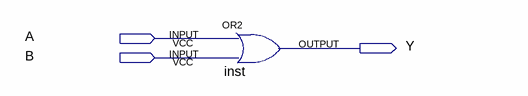
[diagram p0: schematic sheet]
// Quartus schematic Ex1.bdf as structural Verilog: 1 symbols, 3 pins
module Ex1 (
  input  A,
  input  B,
  output Y
);

  or inst (Y, A, B);
endmodule
